# EAGLE design pHORPBoard_V10 (EAGLE 7.7.0)

## Sheet 1 of 3
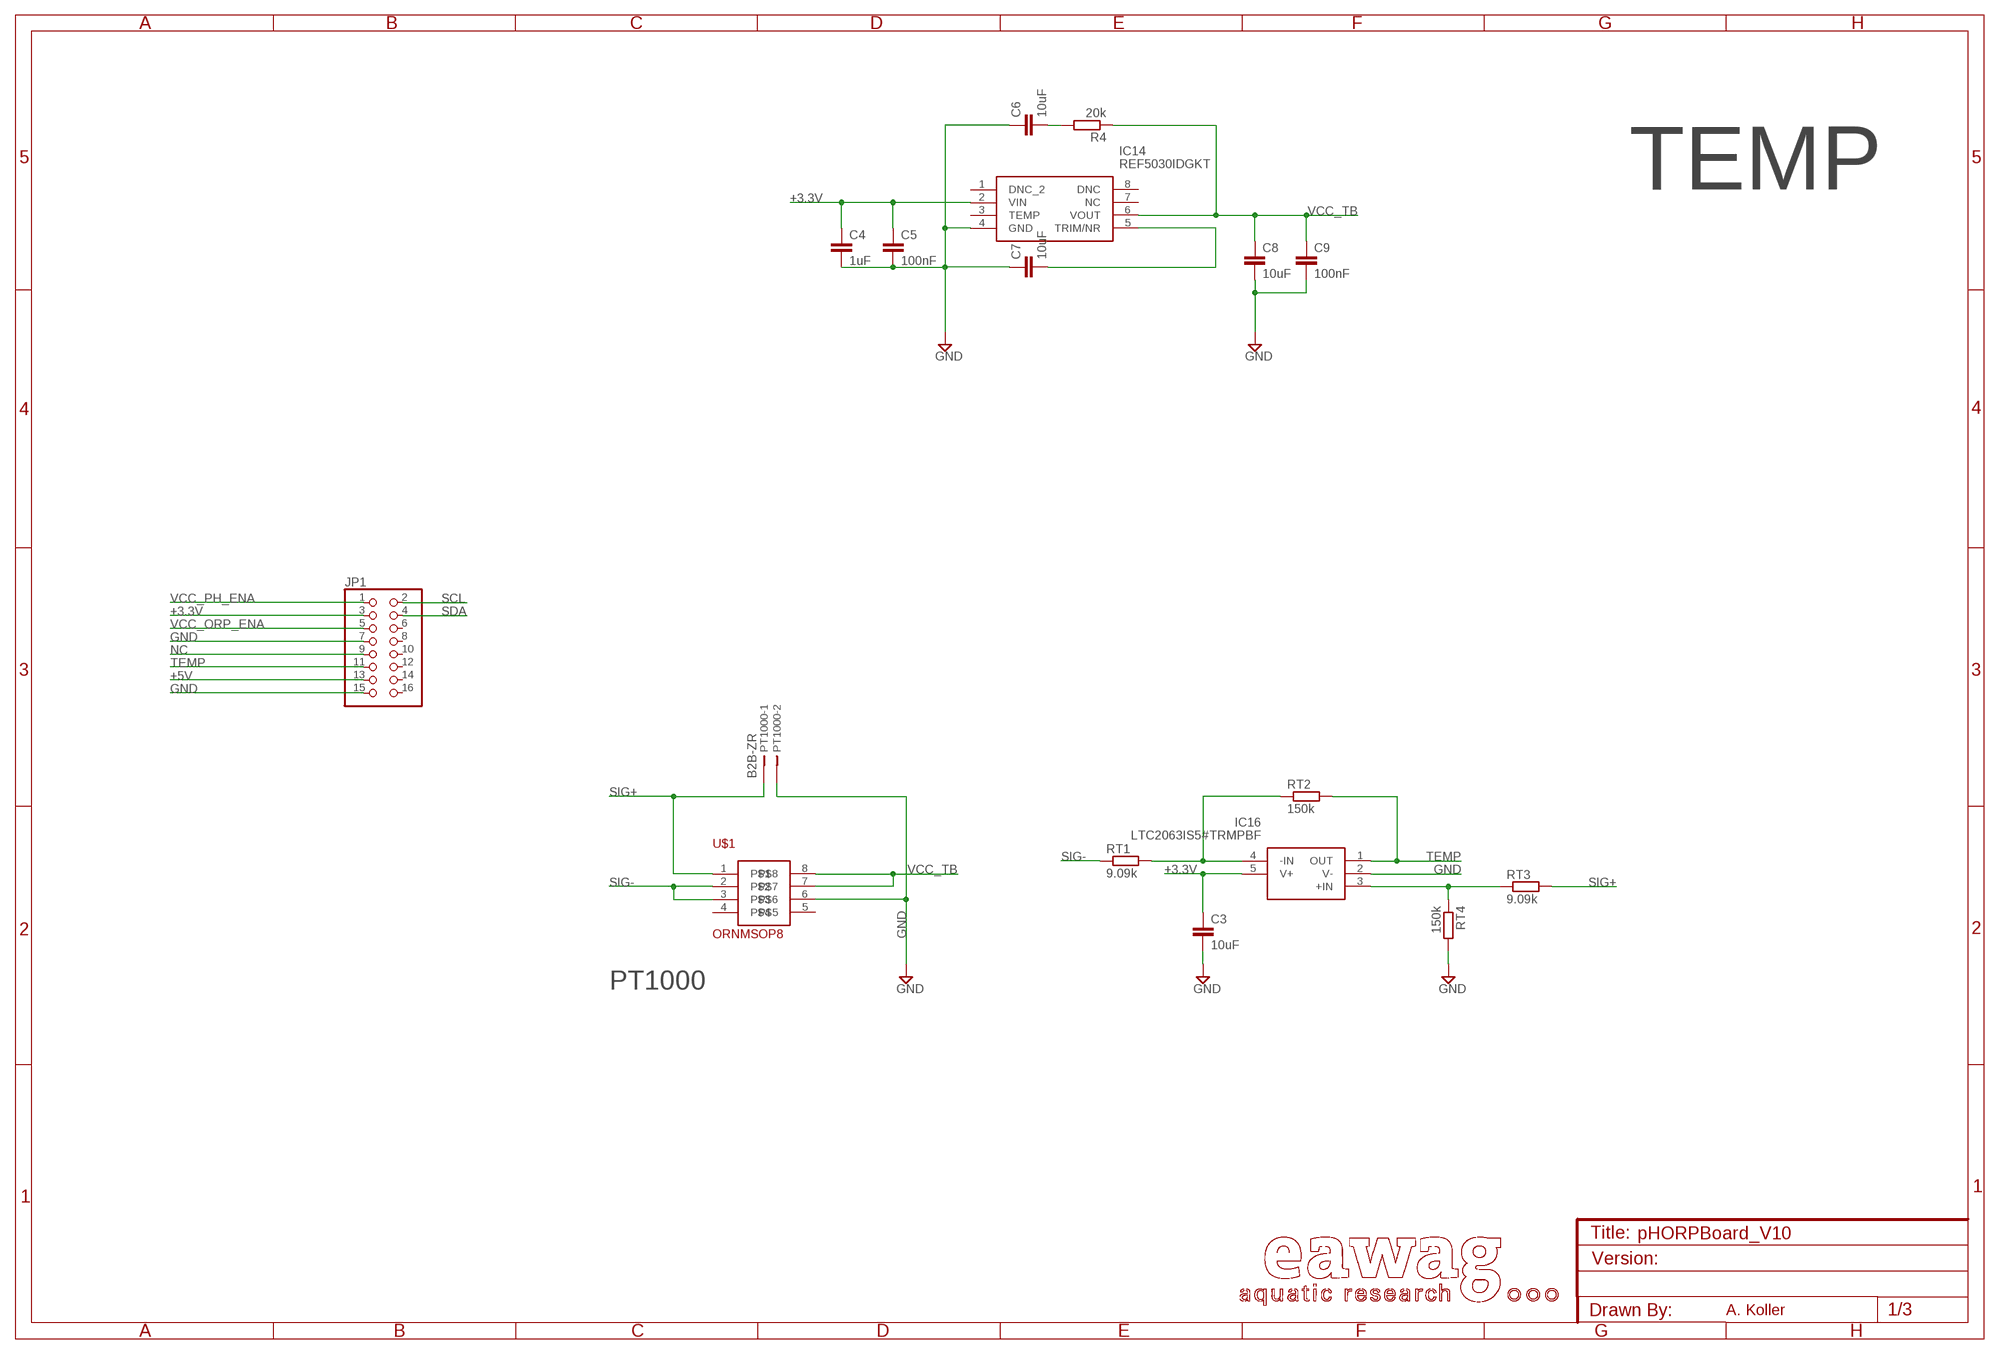
[diagram p0: schematic, sheet 1]

### Parts
C3  10uF  C-EUC0603  [C0603]
C4  1uF  C-EUC0603  [C0603]
C5  100nF  C-EUC0603  [C0603]
C6  10uF  C-EUC0603  [C0603]
C7  10uF  C-EUC0603  [C0603]
C8  10uF  C-EUC0603  [C0603]
C9  100nF  C-EUC0603  [C0603]
IC14  REF5030IDGKT  [SOP65P490X110-8N]
IC16  LTC2063IS5#TRMPBF  [SOT95P280X100-5N]
JP1  PINHD-2X8  [2X08]
PT1000  B2B-ZR  [B2B-ZR]
R4  20k  R-EU_R0603  [R0603]
RT1  9.09k  R-EU_R0603  [R0603]
RT2  150k  R-EU_R0603  [R0603]
RT3  9.09k  R-EU_R0603  [R0603]
RT4  150k  R-EU_R0603  [R0603]
U$1  ORNMSOP8  [MSOP8]

### Nets
+3.3V: C3.1 C4.1 C5.1 IC14.2(VIN) IC16.5(V+) JP1.3
+5V: JP1.13 ; also sheet 2,3
GND: C3.2 C4.2 C5.2 C6.1 C7.1 C8.2 C9.2 IC14.4(GND) IC16.2(V-) JP1.7 JP1.15 PT1000.2 RT4.2 U$1.6 ; also sheet 2,3
N$3: IC16.4(-IN) RT1.2 RT2.1
N$7: IC16.3(+IN) RT3.1 RT4.1
N$9: C6.2 R4.2
N$21: C7.2 IC14.5(TRIM/NR)
NC: JP1.9
SCL: JP1.2 ; also sheet 2,3
SDA: JP1.4 ; also sheet 2,3
SIG+: PT1000.1 RT3.2 U$1.1
SIG-: RT1.1 U$1.2 U$1.3
TEMP: IC16.1(OUT) JP1.11 RT2.2
VCC_ORP_ENA: JP1.5 ; also sheet 2
VCC_PH_ENA: JP1.1 ; also sheet 3
VCC_TB: C8.1 C9.1 IC14.6(VOUT) R4.1 U$1.7 U$1.8
Unconnected: IC14.1(DNC_2) IC14.3(TEMP) IC14.7(NC) IC14.8(DNC) JP1.6 JP1.8 JP1.10 JP1.12 JP1.14 JP1.16 U$1.4 U$1.5

### Notes on the sheet
- TEMP
- PT1000
- A. Koller

## Sheet 2 of 3
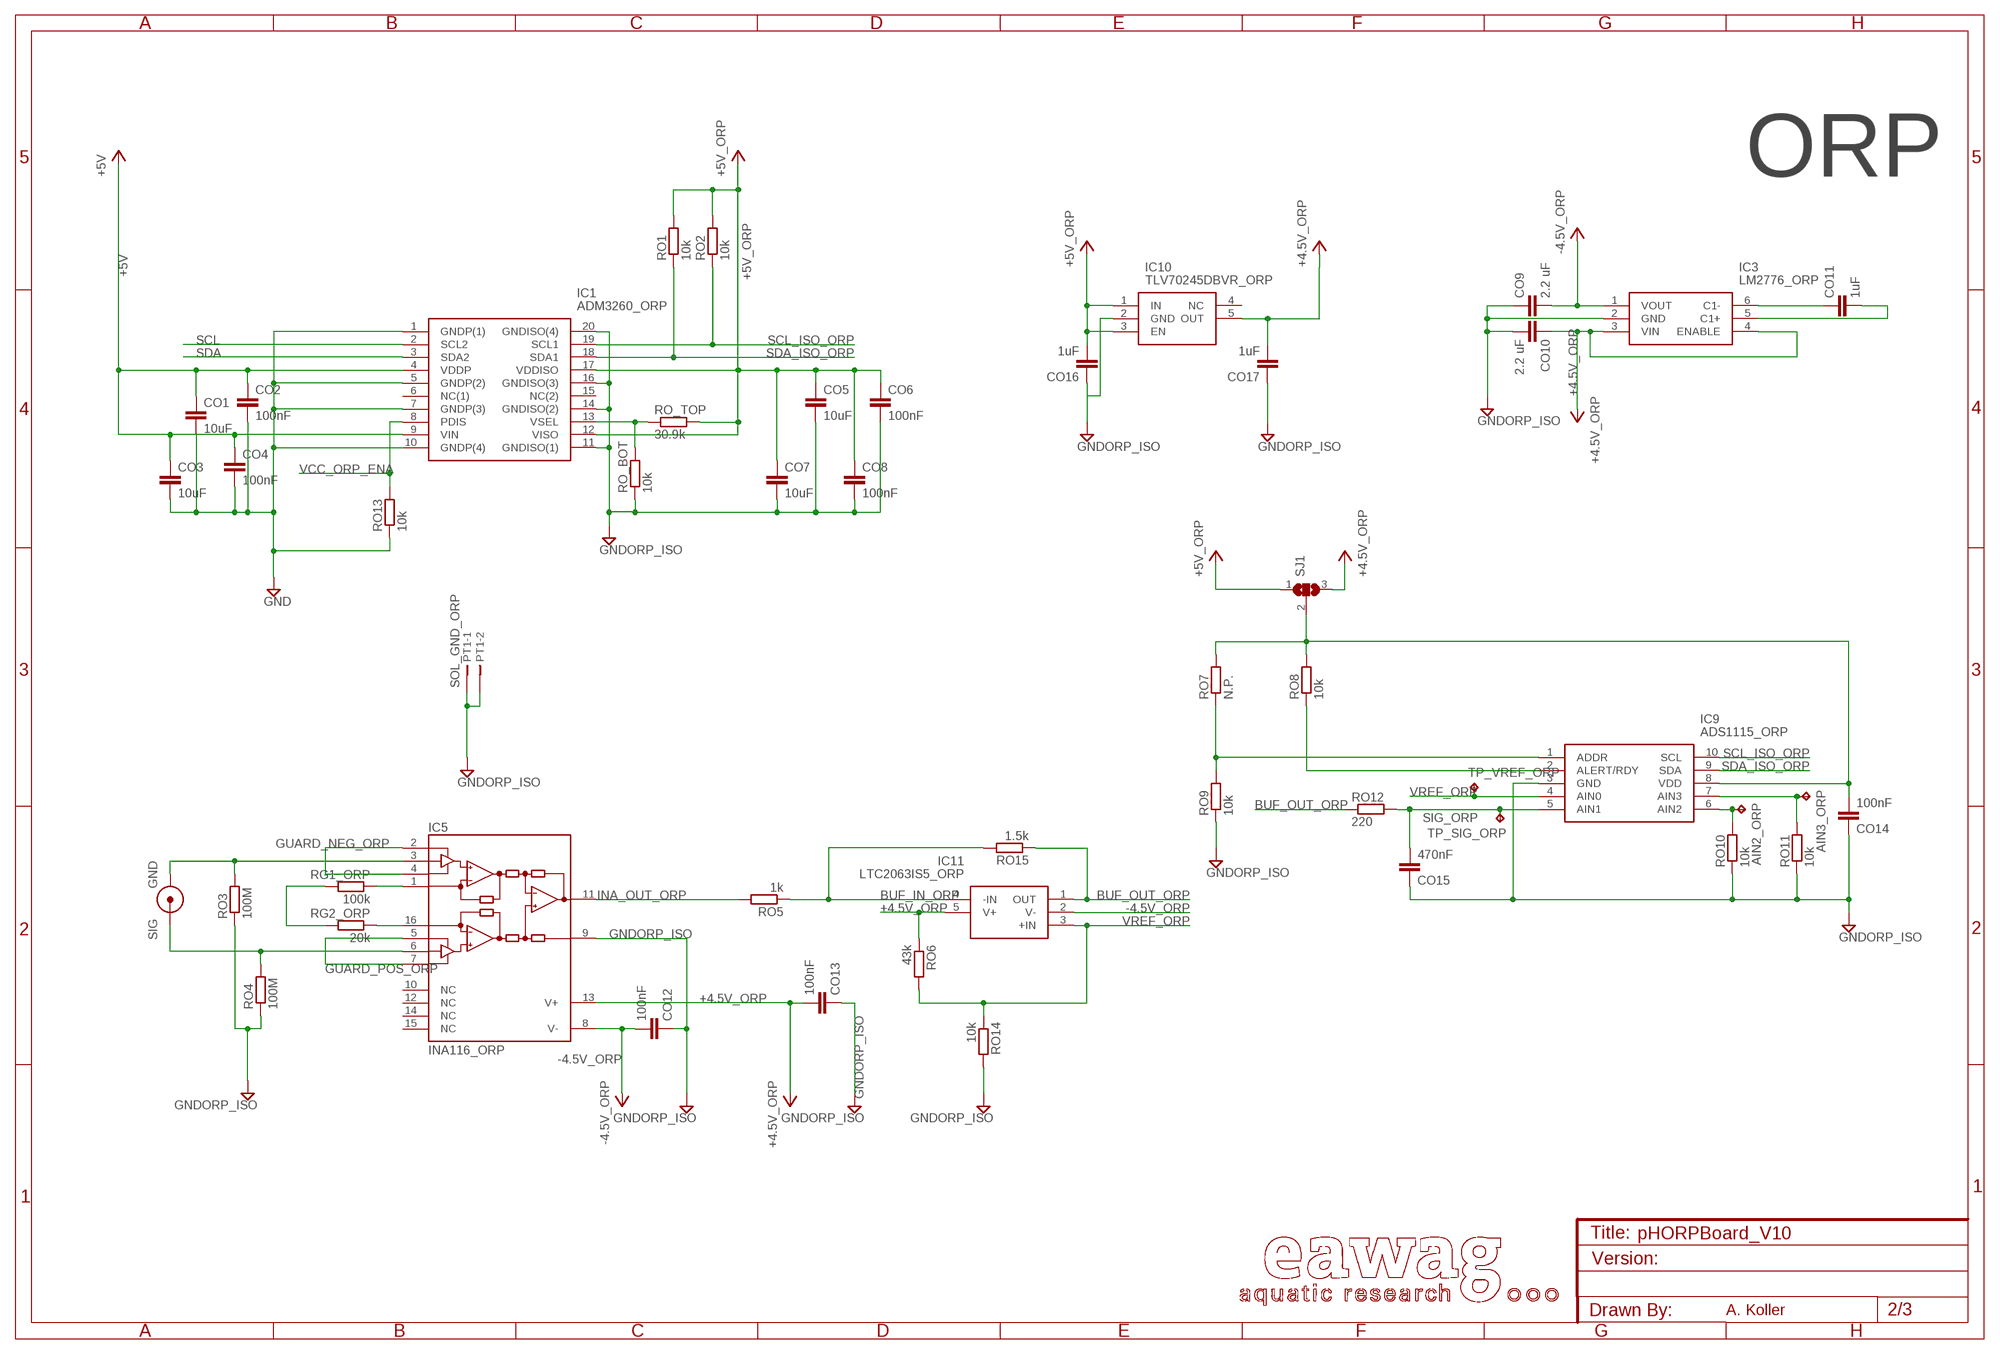
[diagram p1: schematic, sheet 2]

### Parts
AIN2_ORP  TPB1,27  [B1,27]
AIN3_ORP  TPB1,27  [B1,27]
CO1  10uF  C-EUC0603  [C0603]
CO2  100nF  C-EUC0603  [C0603]
CO3  10uF  C-EUC0603  [C0603]
CO4  100nF  C-EUC0603  [C0603]
CO5  10uF  C-EUC0603  [C0603]
CO6  100nF  C-EUC0603  [C0603]
CO7  10uF  C-EUC0603  [C0603]
CO8  100nF  C-EUC0603  [C0603]
CO9  2.2 uF  C-EUC0603  [C0603]
CO10  2.2 uF  C-EUC0603  [C0603]
CO11  1uF  C-EUC0603  [C0603]
CO12  100nF  C-EUC0603  [C0603]
CO13  100nF  C-EUC0603  [C0603]
CO14  100nF  C-EUC0603  [C0603]
CO15  470nF  C-EUC0603  [C0603]
CO16  1uF  C-EUC0603  [C0603]
CO17  1uF  C-EUC0603  [C0603]
IC1  ADM3260_ORP  ADM3260ARSZ-RL7  [SOP65P780X200-20N]
IC3  LM2776_ORP  LM2776DBVT  [SOT95P280X145-6N]
IC5  INA116_ORP  INA116U  [SO16-1]
IC9  ADS1115_ORP  ADS1115IDGST  [SOP50P490X110-10N]
IC10  TLV70245DBVR_ORP  TLV70245DBVR  [SOT95P280X145-5N]
IC11  LTC2063IS5_ORP  LTC2063IS5#TRMPBF  [SOT95P280X100-5N]
ORP  CON_HANNACON_HANNA_2  [CON_HANNA_2]
PT1  SOL_GND_ORP  B2B-ZR  [B2B-ZR]
RG1_ORP  100k  R-EU_R0603  [R0603]
RG2_ORP  20k  R-EU_R0603  [R0603]
RO1  10k  R-EU_R0603  [R0603]
RO2  10k  R-EU_R0603  [R0603]
RO3  100M  R-EU_R0603  [R0603]
RO4  100M  R-EU_R0603  [R0603]
RO5  1k  R-EU_R0603  [R0603]
RO6  43k  R-EU_R0603  [R0603]
RO7  N.P.  R-EU_R0603  [R0603]
RO8  10k  R-EU_R0603  [R0603]
RO9  10k  R-EU_R0603  [R0603]
RO10  10k  R-EU_R0603  [R0603]
RO11  10k  R-EU_R0603  [R0603]
RO12  220  R-EU_R0603  [R0603]
RO13  10k  R-EU_R0603  [R0603]
RO14  10k  R-EU_R0603  [R0603]
RO15  1.5k  R-EU_R0603  [R0603]
RO_BOT  10k  R-EU_R0603  [R0603]
RO_TOP  30.9k  R-EU_R0603  [R0603]
SJ1  SJ2W  [SJ_2]
TP_SIG_ORP  TPB1,27  [B1,27]
TP_VREF_ORP  TPB1,27  [B1,27]

### Nets
+4.5V_ORP: CO10.1 CO13.2 CO17.2 IC3.3(VIN) IC3.4(ENABLE) IC5.13(V+) IC10.5(OUT) IC11.5(V+) RO6.1 SJ1.3
+5V: CO1.1 CO2.1 CO3.1 CO4.1 IC1.4(VDDP) IC1.9(VIN) ; also sheet 1,3
+5V_ORP: CO5.1 CO6.1 CO7.1 CO8.1 CO16.2 IC1.12(VISO) IC1.17(VDDISO) IC10.1(IN) IC10.3(EN) RO1.2 RO2.2 RO_TOP.2 SJ1.1
-4.5V_ORP: CO9.2 CO12.2 IC3.1(VOUT) IC5.8(V-) IC11.2(V-)
BUF_IN_ORP: IC11.4(-IN) RO5.1 RO15.2
BUF_OUT_ORP: IC11.1(OUT) RO12.1 RO15.1
GND: CO1.2 CO2.2 CO3.2 CO4.2 IC1.1(GNDP(1)) IC1.5(GNDP(2)) IC1.7(GNDP(3)) IC1.10(GNDP(4)) RO13.1 ; also sheet 1,3
GNDORP_ISO: CO5.2 CO6.2 CO7.2 CO8.2 CO9.1 CO10.2 CO12.1 CO13.1 CO14.1 CO15.1 CO16.1 CO17.1 IC1.11(GNDISO(1)) IC1.14(GNDISO(2)) IC1.16(GNDISO(3)) IC1.20(GNDISO(4)) IC3.2(GND) IC5.9(REF) IC9.3(GND) IC10.2(GND) PT1.1 PT1.2 RO3.1 RO4.1 RO9.1 RO10.1 RO11.1 RO14.2 RO_BOT.1
GUARD_NEG_ORP: IC5.2(GUARD-) IC5.4(GUARD-)
GUARD_POS_ORP: IC5.5(GUARD+) IC5.7(GUARD+)
INA_OUT_ORP: IC5.11(OUT) RO5.2
N$6: IC5.6(+IN) ORP.CON_SIG RO4.2
N$10: CO11.1 IC3.6(C1-)
N$11: CO11.2 IC3.5(C1+)
N$12: IC5.3(-IN) ORP.CON_GND RO3.2
N$13: IC5.1(RG) RG1_ORP.1
N$14: RG1_ORP.2 RG2_ORP.2
N$20: IC5.16(RG) RG2_ORP.1
N$22: IC9.1(ADDR) RO7.1 RO9.2
N$23: IC9.2(ALERT/RDY) RO8.1
N$24: AIN2_ORP.TP IC9.6(AIN2) RO10.2
N$25: AIN3_ORP.TP IC9.7(AIN3) RO11.2
SCL: IC1.2(SCL2) ; also sheet 1,3
SCL_ISO_ORP: IC1.19(SCL1) IC9.10(SCL) RO2.1
SDA: IC1.3(SDA2) ; also sheet 1,3
SDA_ISO_ORP: IC1.18(SDA1) IC9.9(SDA) RO1.1
SIG_ORP: CO15.2 IC9.5(AIN1) RO12.2 TP_SIG_ORP.TP
SUPP_ADS_ORP: CO14.2 IC9.8(VDD) RO7.2 RO8.2 SJ1.2
VCC_ORP_ENA: IC1.8(PDIS) RO13.2 ; also sheet 1
VREF_ORP: IC9.4(AIN0) IC11.3(+IN) RO6.2 RO14.1 TP_VREF_ORP.TP
VSEL: IC1.13(VSEL) RO_BOT.2 RO_TOP.1
Unconnected: IC1.6(NC(1)) IC1.15(NC(2)) IC5.10(NC) IC5.12(NC) IC5.14(NC) IC5.15(NC) IC10.4(NC)

### Notes on the sheet
- ORP
- A. Koller

## Sheet 3 of 3
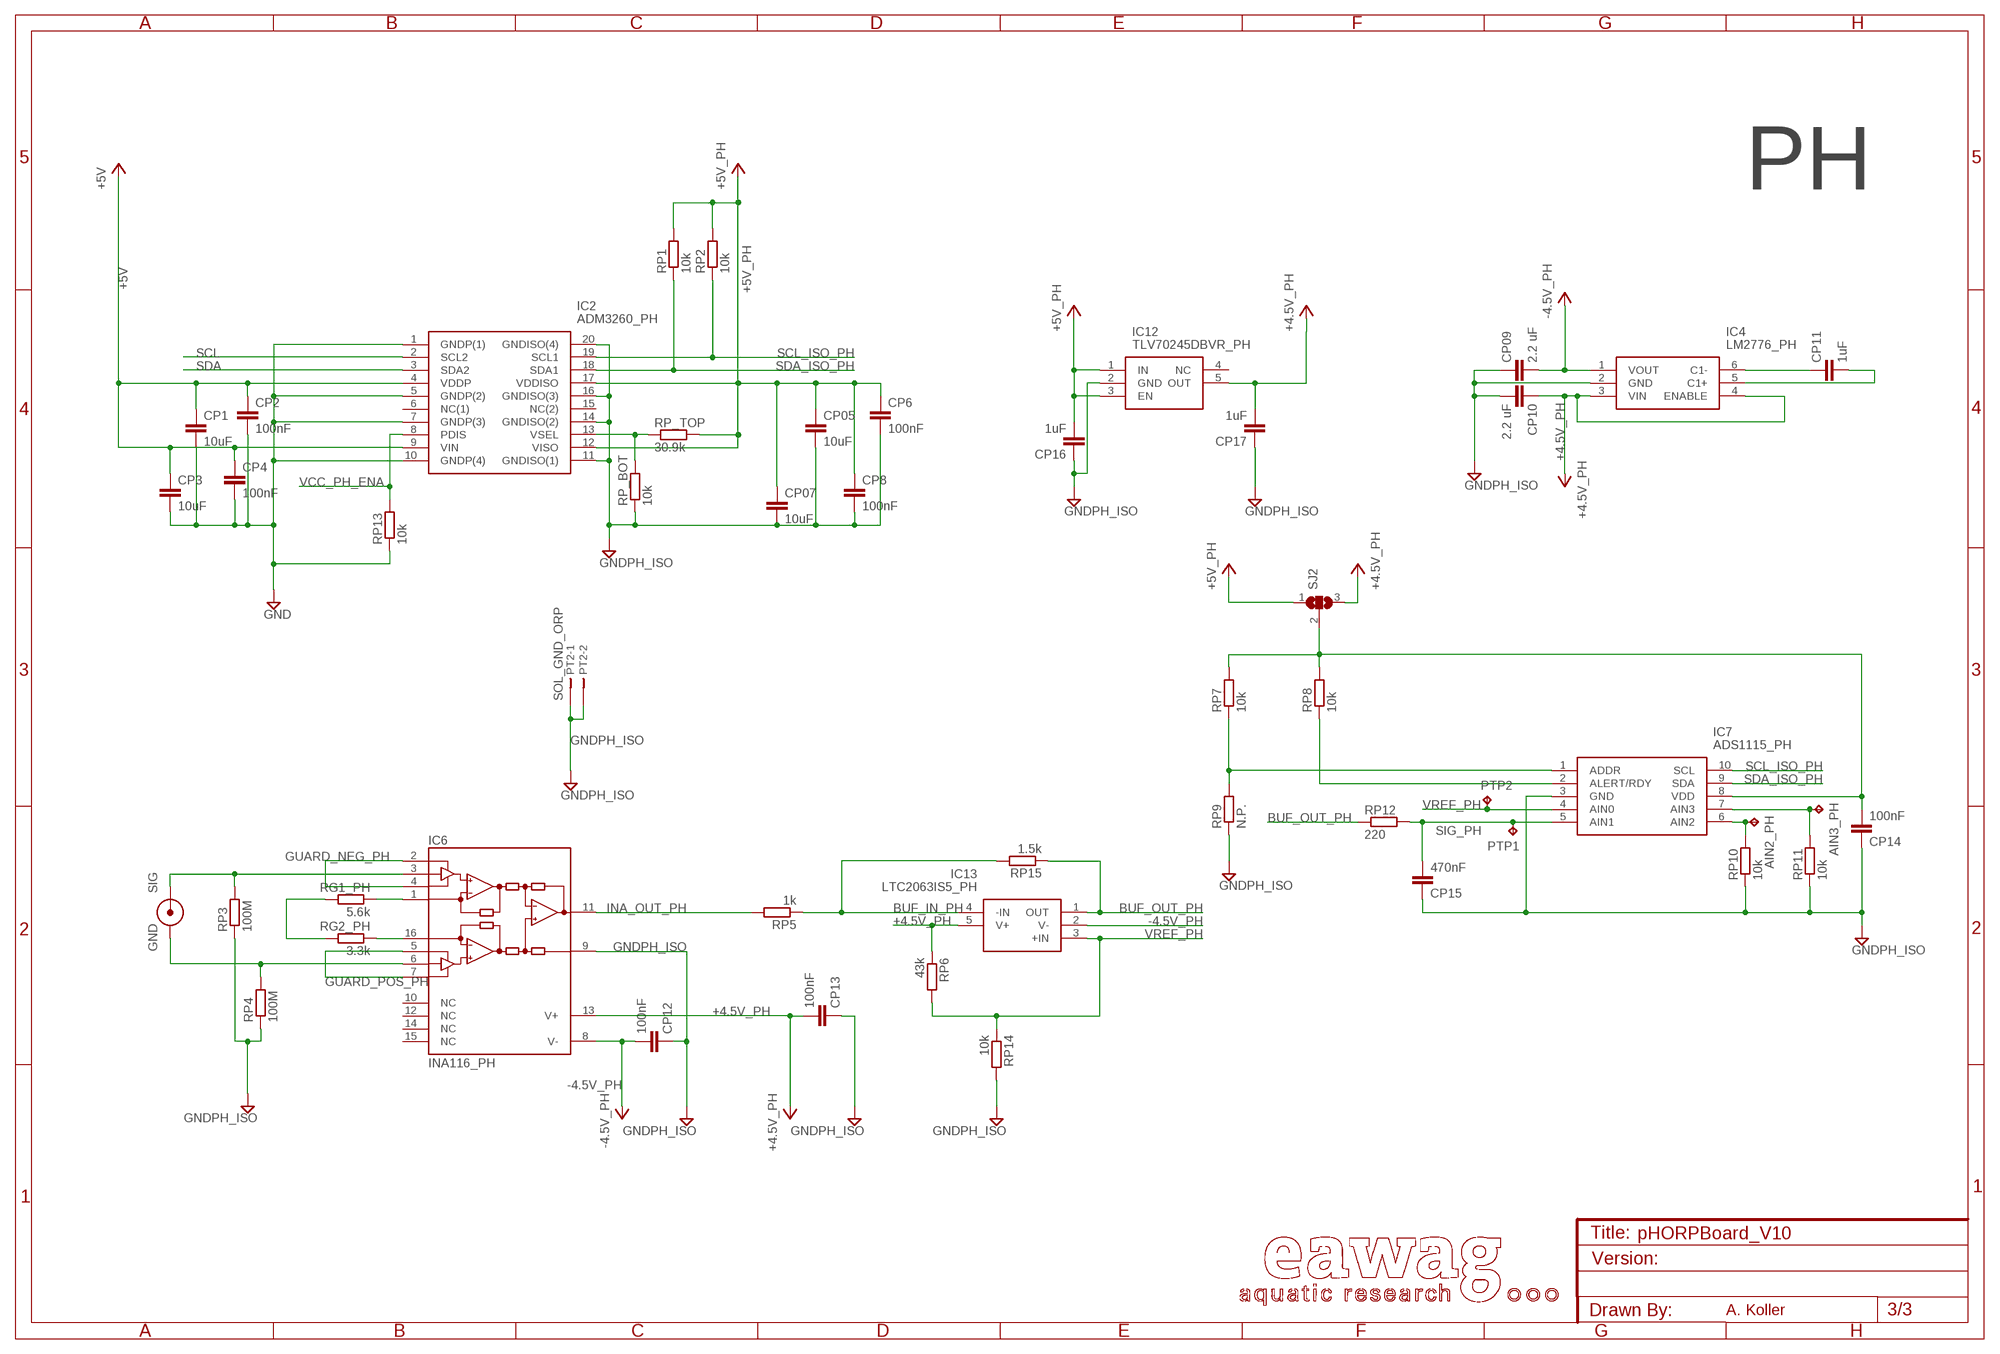
[diagram p2: schematic, sheet 3]

### Parts
AIN2_PH  TPB1,27  [B1,27]
AIN3_PH  TPB1,27  [B1,27]
CP1  10uF  C-EUC0603  [C0603]
CP2  100nF  C-EUC0603  [C0603]
CP3  10uF  C-EUC0603  [C0603]
CP4  100nF  C-EUC0603  [C0603]
CP05  10uF  C-EUC0603  [C0603]
CP6  100nF  C-EUC0603  [C0603]
CP07  10uF  C-EUC0603  [C0603]
CP8  100nF  C-EUC0603  [C0603]
CP09  2.2 uF  C-EUC0603  [C0603]
CP10  2.2 uF  C-EUC0603  [C0603]
CP11  1uF  C-EUC0603  [C0603]
CP12  100nF  C-EUC0603  [C0603]
CP13  100nF  C-EUC0603  [C0603]
CP14  100nF  C-EUC0603  [C0603]
CP15  470nF  C-EUC0603  [C0603]
CP16  1uF  C-EUC0603  [C0603]
CP17  1uF  C-EUC0603  [C0603]
IC2  ADM3260_PH  ADM3260ARSZ-RL7  [SOP65P780X200-20N]
IC4  LM2776_PH  LM2776DBVT  [SOT95P280X145-6N]
IC6  INA116_PH  INA116U  [SO16-1]
IC7  ADS1115_PH  ADS1115IDGST  [SOP50P490X110-10N]
IC12  TLV70245DBVR_PH  TLV70245DBVR  [SOT95P280X145-5N]
IC13  LTC2063IS5_PH  LTC2063IS5#TRMPBF  [SOT95P280X100-5N]
PH  CON_HANNA  [CON_HANNA]
PT2  SOL_GND_ORP  B2B-ZR  [B2B-ZR]
PTP1  TPB1,27  [B1,27]
PTP2  TPB1,27  [B1,27]
RG1_PH  5.6k  R-EU_R0603  [R0603]
RG2_PH  3.3k  R-EU_R0603  [R0603]
RP1  10k  R-EU_R0603  [R0603]
RP2  10k  R-EU_R0603  [R0603]
RP3  100M  R-EU_R0603  [R0603]
RP4  100M  R-EU_R0603  [R0603]
RP5  1k  R-EU_R0603  [R0603]
RP6  43k  R-EU_R0603  [R0603]
RP7  10k  R-EU_R0603  [R0603]
RP8  10k  R-EU_R0603  [R0603]
RP9  N.P.  R-EU_R0603  [R0603]
RP10  10k  R-EU_R0603  [R0603]
RP11  10k  R-EU_R0603  [R0603]
RP12  220  R-EU_R0603  [R0603]
RP13  10k  R-EU_R0603  [R0603]
RP14  10k  R-EU_R0603  [R0603]
RP15  1.5k  R-EU_R0603  [R0603]
RP_BOT  10k  R-EU_R0603  [R0603]
RP_TOP  30.9k  R-EU_R0603  [R0603]
SJ2  SJ2W  [SJ_2]

### Nets
+4.5V_PH: CP10.1 CP13.2 CP17.2 IC4.3(VIN) IC4.4(ENABLE) IC6.13(V+) IC12.5(OUT) IC13.5(V+) RP6.1 SJ2.3
+5V: CP1.1 CP2.1 CP3.1 CP4.1 IC2.4(VDDP) IC2.9(VIN) ; also sheet 1,2
+5V_PH: CP05.1 CP6.1 CP07.1 CP8.1 CP16.2 IC2.12(VISO) IC2.17(VDDISO) IC12.1(IN) IC12.3(EN) RP1.2 RP2.2 RP_TOP.2 SJ2.1
-4.5V_PH: CP09.2 CP12.2 IC4.1(VOUT) IC6.8(V-) IC13.2(V-)
BUF_IN_PH: IC13.4(-IN) RP5.1 RP15.2
BUF_OUT_PH: IC13.1(OUT) RP12.1 RP15.1
GND: CP1.2 CP2.2 CP3.2 CP4.2 IC2.1(GNDP(1)) IC2.5(GNDP(2)) IC2.7(GNDP(3)) IC2.10(GNDP(4)) RP13.1 ; also sheet 1,2
GNDPH_ISO: CP05.2 CP6.2 CP07.2 CP8.2 CP09.1 CP10.2 CP12.1 CP13.1 CP14.1 CP15.1 CP16.1 CP17.1 IC2.11(GNDISO(1)) IC2.14(GNDISO(2)) IC2.16(GNDISO(3)) IC2.20(GNDISO(4)) IC4.2(GND) IC6.9(REF) IC7.3(GND) IC12.2(GND) PT2.1 PT2.2 RP3.1 RP4.1 RP9.1 RP10.1 RP11.1 RP14.2 RP_BOT.1
GUARD_NEG_PH: IC6.2(GUARD-) IC6.4(GUARD-)
GUARD_POS_PH: IC6.5(GUARD+) IC6.7(GUARD+)
INA_OUT_PH: IC6.11(OUT) RP5.2
N$1: CP11.1 IC4.6(C1-)
N$2: CP11.2 IC4.5(C1+)
N$4: IC6.1(RG) RG1_PH.1
N$5: RG1_PH.2 RG2_PH.2
N$16: IC6.16(RG) RG2_PH.1
N$18: IC6.6(+IN) PH.CON_GND RP4.2
N$26: IC6.3(-IN) PH.CON_SIG RP3.2
N$27: IC7.1(ADDR) RP7.1 RP9.2
N$28: IC7.2(ALERT/RDY) RP8.1
N$31: AIN2_PH.TP IC7.6(AIN2) RP10.2
N$32: AIN3_PH.TP IC7.7(AIN3) RP11.2
SCL: IC2.2(SCL2) ; also sheet 1,2
SCL_ISO_PH: IC2.19(SCL1) IC7.10(SCL) RP2.1
SDA: IC2.3(SDA2) ; also sheet 1,2
SDA_ISO_PH: IC2.18(SDA1) IC7.9(SDA) RP1.1
SIG_PH: CP15.2 IC7.5(AIN1) PTP1.TP RP12.2
SUPP_ADS_PH: CP14.2 IC7.8(VDD) RP7.2 RP8.2 SJ2.2
VCC_PH_ENA: IC2.8(PDIS) RP13.2 ; also sheet 1
VREF_PH: IC7.4(AIN0) IC13.3(+IN) PTP2.TP RP6.2 RP14.1
VSEL1: IC2.13(VSEL) RP_BOT.2 RP_TOP.1
Unconnected: IC2.6(NC(1)) IC2.15(NC(2)) IC6.10(NC) IC6.12(NC) IC6.14(NC) IC6.15(NC) IC12.4(NC)

### Notes on the sheet
- PH
- A. Koller

## Library data of the parts
AIN2_ORP AIN2_PH AIN3_ORP AIN3_PH PTP1 PTP2 TP_SIG_ORP TP_VREF_ORP = testpad:TP: Test pad
C3-C9 CO1 CO3 CO7 CP1 CP3 CP05 CP07 CP10 = 1_RCL-eawag:C-EU: CAPACITOR, European symbol
CO2 CO4-CO6 CO8-CO17 CP2 CP4 CP6 CP8 CP09 CP11-CP17 = rcl:C-EU: CAPACITOR, European symbol
IC1 IC2 = ADM3260ARSZ-RL7:ADM3260ARSZ-RL7: Digital Isolators Isolated I2C & Power Source: Datasheet <https://componentsearchengine.com/Datasheets/1/ADM3260ARSZ-RL7.pdf>; DESCRIPTION: Digital Isolators Isolated I2C & Power; HEIGHT: 2mm; MANUFACTURER_NAME: Analog Devices; MANUFACTURER_PART_NUMBER: ADM3260ARSZ-RL7; SUPPLIER_NAME: RS
IC3 IC4 = LM2776DBVT:LM2776DBVT: TEXAS INSTRUMENTS - LM2776DBVT - CHARGE PUMP, INV, -2.7V TO -5.5V, SOT-23 Source: Datasheet <http://www.ti.com/lit/ds/symlink/lm2776.pdf>; DESCRIPTION: TEXAS INSTRUMENTS - LM2776DBVT - CHARGE PUMP, INV, -2.7V TO -5.5V, SOT-23; HEIGHT: 1.45mm; MANUFACTURER_NAME: Texas Instruments; MANUFACTURER_PART_NUMBER: LM2776DBVT; SUPPLIER_NAME: RS
IC5 IC6 = burr-brown:INA116: Instrumentation Amplifier Ultra Low Input Bias Current; MF: TEXAS INSTRUMENTS; MPN: INA116UA; OC_FARNELL: 1212402; OC_NEWARK: 35C1717
IC7 IC9 = ADS1115IDGST:ADS1115IDGST: 16-Bit, 860SPS, 4-Ch Delta-Sigma ADC w/ PGA, Oscillator, Voltage Reference, Comparator & I2C Source: Datasheet <http://docs-europe.electrocomponents.com/webdocs/0e31/0900766b80e31b07.pdf>; DESCRIPTION: 16-Bit, 860SPS, 4-Ch Delta-Sigma ADC w/ PGA, Oscillator, Voltage Reference, Comparator & I2C; HEIGHT: 1.1mm; MANUFACTURER_NAME: Texas Instruments; MANUFACTURER_PART_NUMBER: ADS1115IDGST; RS_PART_NUMBER: 9236911; RS_PRICE/STOCK: http://uk.rs-online.com/web/p/products/9236911
IC10 IC12 = TLV70245DBVR:TLV70245DBVR: LDO Voltage Regulators 300mALow IQLDO Reg Source: Datasheet <http://www.ti.com/lit/ds/symlink/tlv702.pdf>; ARROW_PART_NUMBER: TLV70245DBVR; ARROW_PRICE/STOCK: https://www.arrow.com/en/products/TLV70245dbvr/texas-instruments; DESCRIPTION: LDO Voltage Regulators 300mALow IQLDO Reg; HEIGHT: 1.45mm; MANUFACTURER_NAME: Texas Instruments; MANUFACTURER_PART_NUMBER: TLV70245DBVR
IC11 IC13 IC16 = LTC2063IS5#TRMPBF:LTC2063IS5#TRMPBF: LINEAR TECHNOLOGY - LTC2063IS5#TRMPBF - OP-AMP, 20KHZ, 0.0035V/US, TSOT23-5 Source: Datasheet <http://cds.linear.com/docs/en/datasheet/2063f.pdf>; ARROW_PART_NUMBER: LTC2063IS5#TRMPBF; ARROW_PRICE/STOCK: https://www.arrow.com/en/products/ltc2063is5trmpbf/linear-technology; DESCRIPTION: LINEAR TECHNOLOGY - LTC2063IS5#TRMPBF - OP-AMP, 20KHZ, 0.0035V/US, TSOT23-5; HEIGHT: 1mm; MANUFACTURER_NAME: Linear Technology; MANUFACTURER_PART_NUMBER: LTC2063IS5#TRMPBF
IC14 = REF5030IDGKT:REF5030IDGKT: VOLTAGE REFERENCE Source: Datasheet; ARROW_PART_NUMBER: REF5030IDGKT; DESCRIPTION: VOLTAGE REFERENCE; HEIGHT: mm; MANUFACTURER_NAME: Texas Instruments; MANUFACTURER_PART_NUMBER: REF5030IDGKT
JP1 = pinhead:PINHD-2X8: PIN HEADER
ORP PH = eawag:CON_HANNA
PT1 PT2 PT1000 = con-jst:B2B-ZR: ZH CONNECTOR 1.5 mm, 2 pin 1 row Source: http://www.jst.com .. eZH.pdf
R4 RG1_ORP RG1_PH RG2_ORP RG2_PH RO1-RO15 RO_BOT RO_TOP RP1-RP15 RP_BOT RP_TOP RT1-RT4 = resistor:R-EU_: RESISTOR, European symbol
SJ1 SJ2 = jumper:SJ2W: SMD solder JUMPER
U$1 = eawag:ORN

## Board
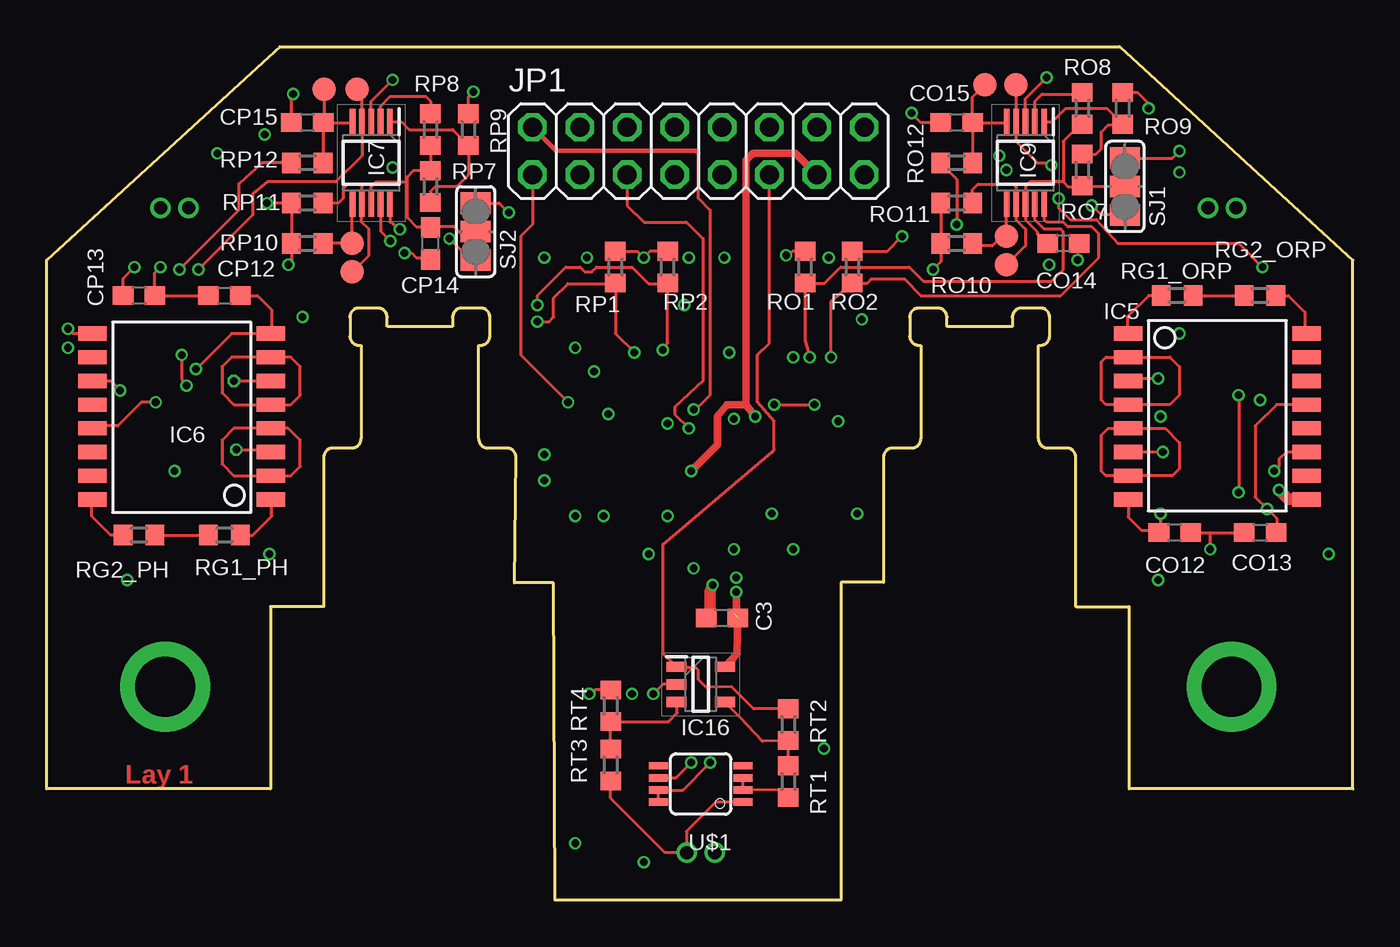
[diagram p3: board, top side]
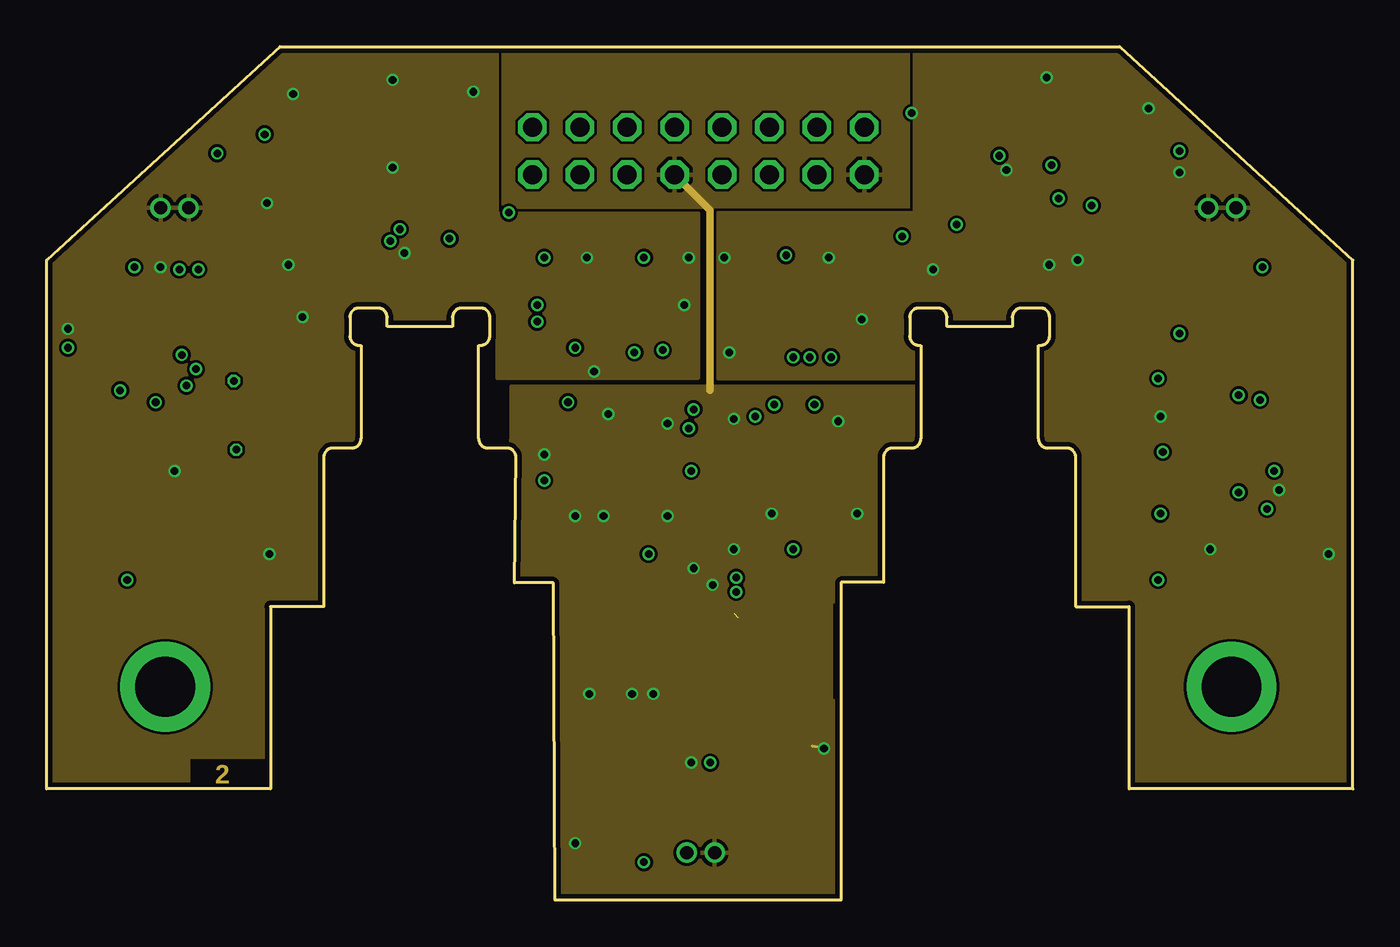
[diagram p4: board, inner layer Grounds]
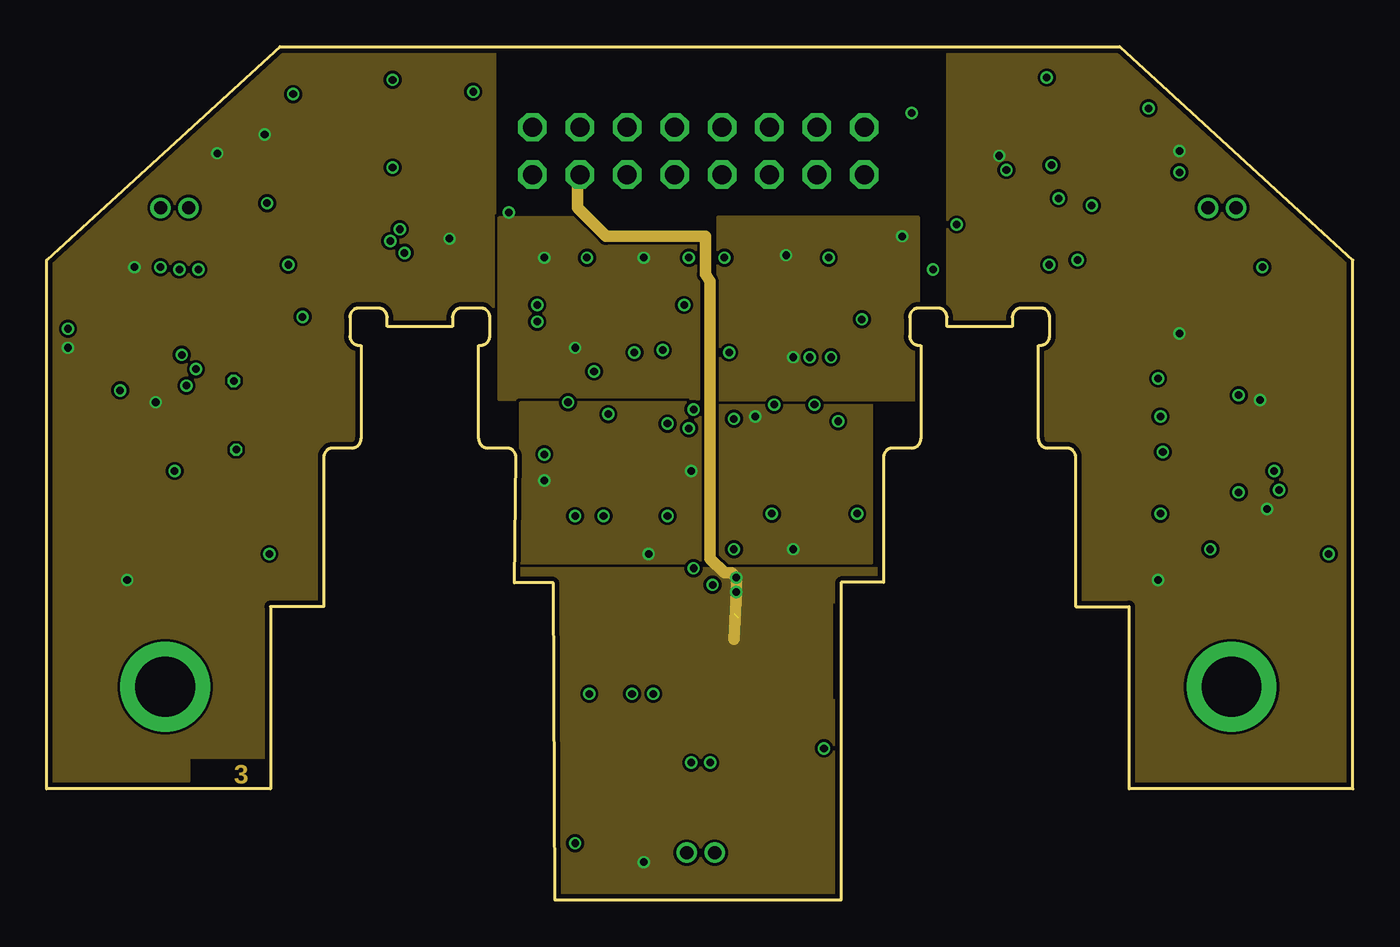
[diagram p5: board, inner layer Powers]
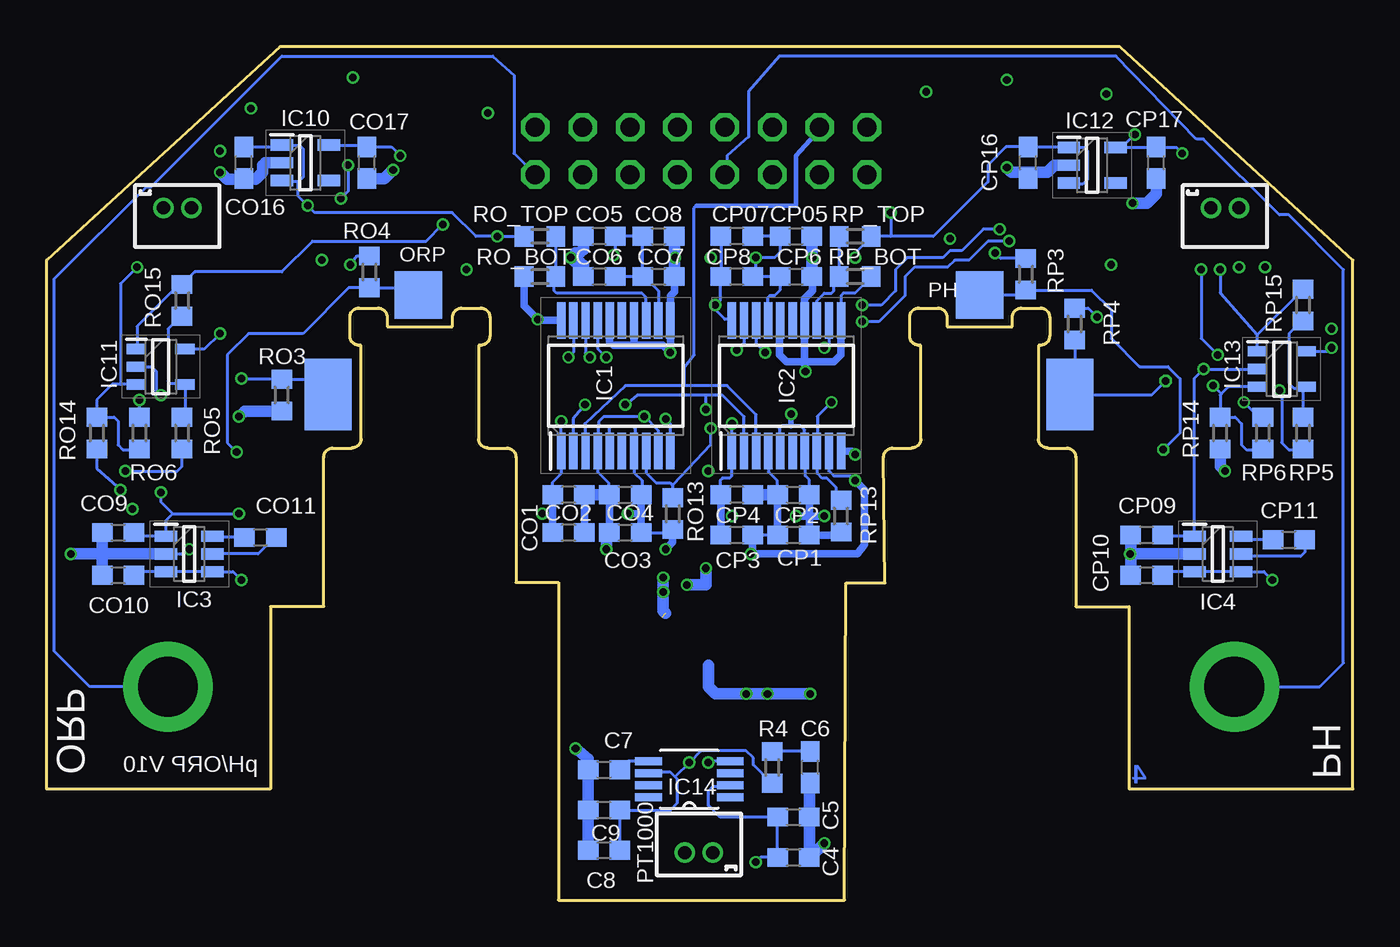
[diagram p6: board, bottom side, seen from below]

Size 70 x 45.72 mm. Coordinates in mm from the lower left corner, seen from the top.
Outline: 44.85,17.02 42.57,17.02 42.57,0 27.24,0 27.16,16.99 25.07,16.99 25.15,23.72 arc90 24.65,24.22 23.65,24.22 arc-90 23.15,24.72 23.15,29.72 23.25,29.72 arc90 23.75,30.22 23.75,31.22 arc90 23.25,31.72 22.25,31.72 arc90 21.75,31.22 21.75,30.72 18.25,30.72 18.25,31.22 arc90 17.75,31.72 16.75,31.72 arc90 16.25,31.22 16.25,30.22 arc90 16.75,29.72 16.85,29.72 16.85,24.72 arc-90 16.35,24.22 15.35,24.22 arc90 14.85,23.72 14.85,15.72 12,15.72 12,5.96 0,5.96 0,34.29 12.5,45.72 57.5,45.72 70,34.29 70,5.96 58,5.96 58,15.72 55.15,15.72 55.15,23.72 arc90 54.65,24.22 53.65,24.22 arc-90 53.15,24.72 53.15,29.72 53.25,29.72 arc90 53.75,30.22 53.75,31.22 arc90 53.25,31.72 52.25,31.72 arc90 51.75,31.22 51.75,30.72 48.25,30.72 48.25,31.22 arc90 47.75,31.72 46.75,31.72 arc90 46.25,31.22 46.25,30.22 arc90 46.75,29.72 46.85,29.72 46.85,24.72 arc-90 46.35,24.22 45.35,24.22 arc90 44.85,23.72 44.85,17.02
Copper layers (1+2*3+16): Top 0.018mm / dielectric 0.36mm / Grounds 0.035mm / dielectric 0.71mm / Powers 0.035mm / dielectric 0.36mm / Bottom 0.018mm
Design rules "eC_4Layer_PClass6_BaseCopperO18-I35_eCDefault": minimum track width 0.15mm, minimum drill 0.35mm, track to track 0.15mm, track to pad 0.15mm, pad to pad 0.15mm, via to via 0.15mm, smd to smd 0mil, copper to edge 0.25mm, drill to drill 0.35mm, minimum pad ring 0.175mm, minimum via ring 0.125mm, stop-mask expansion 0mil, vias tented up to drill 0.45mm, thermal gap 0.2mm

### Footprints (pad centres in the part's own frame; a part is rotated, then mirrored left to right if it is on the bottom)
B1,27 = smd 1.27 x 1.27: TP 0,0
C0603 = smd 1.1 x 1: 1 -0.85,0; 2 0.85,0
SOP65P780X200-20N = smd 1.95 x 0.45: 1 -3.5,2.925; 2 -3.5,2.275; 3 -3.5,1.625; 4 -3.5,0.975; 5 -3.5,0.325; 6 -3.5,-0.325; 7 -3.5,-0.975; 8 -3.5,-1.625; 9 -3.5,-2.275; 10 -3.5,-2.925; 11 3.5,-2.925; 12 3.5,-2.275; 13 3.5,-1.625; 14 3.5,-0.975; 15 3.5,-0.325; 16 3.5,0.325; 17 3.5,0.975; 18 3.5,1.625; 19 3.5,2.275; 20 3.5,2.925
SOT95P280X145-6N = smd 1.2 x 0.6: 1 -1.25,0.95; 2 -1.25,0; 3 -1.25,-0.95; 4 1.25,-0.95; 5 1.25,0; 6 1.25,0.95
SO16-1 = smd 0.762 x 1.524: 1 -4.445,-4.775; 2 -3.175,-4.775; 3 -1.905,-4.775; 4 -0.635,-4.775; 5 0.635,-4.775; 6 1.905,-4.775; 7 3.175,-4.775; 8 4.445,-4.775; 9 4.445,4.775; 10 3.175,4.775; 11 1.905,4.775; 12 0.635,4.775; 13 -0.635,4.775; 14 -1.905,4.775; 15 -3.175,4.775; 16 -4.445,4.775
SOP50P490X110-10N = smd 1.4 x 0.3: 1 -2.2,1; 2 -2.2,0.5; 3 -2.2,0; 4 -2.2,-0.5; 5 -2.2,-1; 6 2.2,-1; 7 2.2,-0.5; 8 2.2,0; 9 2.2,0.5; 10 2.2,1
SOT95P280X145-5N = smd 1.2 x 0.6: 1 -1.25,0.95; 2 -1.25,0; 3 -1.25,-0.95; 4 1.25,-0.95; 5 1.25,0.95
SOT95P280X100-5N = smd 1.05 x 0.55: 1 -1.3,0.95; 2 -1.3,0; 3 -1.3,-0.95; 4 1.3,-0.95; 5 1.3,0.95
SOP65P490X110-8N = smd 1.422 x 0.432: 1 -2.184,0.965; 2 -2.184,0.33; 3 -2.184,-0.33; 4 -2.184,-0.965; 5 2.184,-0.965; 6 2.184,-0.33; 7 2.184,0.33; 8 2.184,0.965
2X08 = drill 1.016 octagon: 1 -8.89,-1.27; 2 -8.89,1.27; 3 -6.35,-1.27; 4 -6.35,1.27; 5 -3.81,-1.27; 6 -3.81,1.27; 7 -1.27,-1.27; 8 -1.27,1.27; 9 1.27,-1.27; 10 1.27,1.27; 11 3.81,-1.27; 12 3.81,1.27; 13 6.35,-1.27; 14 6.35,1.27; 15 8.89,-1.27; 16 8.89,1.27
CON_HANNA_2 = smd 3.81 x 2.54: CON_GND 5.334,-4.826 | smd 2.54 x 2.54: CON_SIG 0,0
CON_HANNA = smd 3.81 x 2.54: CON_GND 5.334,4.826 | smd 2.54 x 2.54: CON_SIG 0,0
B2B-ZR = drill 0.7 pad 1.1: 1 -0.75,0; 2 0.75,0
R0603 = smd 1 x 1.1: 1 -0.85,0; 2 0.85,0
SJ_2 = smd 1.168 x 1.6: 1 -1.524,0; 2 0,0; 3 1.524,0
MSOP8 = smd 0.4 x 1: 1 -0.976,-2.263; 2 -0.326,-2.263; 3 0.324,-2.263; 4 0.974,-2.263; 5 0.974,2.262; 6 0.324,2.262; 7 -0.326,2.262; 8 -0.976,2.262

### Placement (x,y rotation side)
AIN2_ORP  51.44,35.56 0 top
AIN2_PH  16.38,35.18 0 top
AIN3_ORP  51.44,34.04 0 top
AIN3_PH  16.38,33.66 0 top
C3  36.2,15.11 180 top
C4  29.97,2.29 0 bottom
C5  29.97,4.45 0 bottom
C6  29.08,7.11 90 bottom
C7  40.13,6.99 0 bottom
C8  40.13,2.67 180 bottom
C9  40.13,4.83 180 bottom
CO1  42.04,19.68 180 bottom
CO2  42.04,21.72 180 bottom
CO3  38.99,19.68 0 bottom
CO4  38.99,21.72 0 bottom
CO5  40.39,35.56 180 bottom
CO6  40.39,33.4 180 bottom
CO7  37.21,33.4 0 bottom
CO8  37.21,35.56 0 bottom
CO9  66.17,19.68 0 bottom
CO10  66.17,17.4 180 bottom
CO11  58.55,19.43 0 bottom
CO12  60.45,19.68 180 top
CO13  65.02,19.68 0 top
CO14  54.48,35.18 180 top
CO15  48.77,41.66 0 top
CO16  59.44,39.5 90 bottom
CO17  52.83,39.5 90 bottom
CP1  29.97,19.56 0 bottom
CP2  29.97,21.72 0 bottom
CP3  33.02,19.56 180 bottom
CP4  33.02,21.72 180 bottom
CP05  29.84,35.56 0 bottom
CP6  29.84,33.4 0 bottom
CP07  33.02,35.56 180 bottom
CP8  33.02,33.4 180 bottom
CP09  11.05,19.56 0 bottom
CP10  11.05,17.4 180 bottom
CP11  3.43,19.3 0 bottom
CP12  9.53,32.38 0 top
CP13  4.95,32.38 180 top
CP14  20.57,35.18 90 top
CP15  13.97,41.66 0 top
CP16  17.4,39.5 90 bottom
CP17  10.54,39.5 90 bottom
IC1  39.5,27.56 90 bottom
IC2  30.35,27.56 90 bottom
IC3  62.36,18.54 0 bottom
IC4  7.24,18.54 0 bottom
IC5  62.74,25.91 270 top
IC6  7.24,25.91 90 top
IC7  17.4,39.5 270 top
IC9  52.45,39.5 270 top
IC10  56.13,39.5 0 bottom
IC11  63.88,28.57 0 bottom
IC12  13.97,39.37 0 bottom
IC13  3.81,28.45 0 bottom
IC14  35.56,6.48 180 bottom
IC16  35.05,11.56 0 top
JP1  34.92,40.13 0 top
ORP  50.09,32.42 270 bottom
PH  19.99,32.42 270 bottom
PT1  62.99,37.08 0 bottom
PT2  6.86,37.08 0 bottom
PT1000  35.05,2.54 180 bottom
PTP1  14.86,43.43 0 top
PTP2  16.64,43.43 0 top
R4  31.11,7.11 90 bottom
RG1_ORP  60.58,32.38 0 top
RG1_PH  9.53,19.56 180 top
RG2_ORP  65.02,32.38 180 top
RG2_PH  4.95,19.56 0 top
RO1  40.64,33.91 90 top
RO2  43.18,33.91 90 top
RO3  57.4,27.05 90 bottom
RO4  52.7,33.66 270 bottom
RO5  62.74,25.02 270 bottom
RO6  65.02,25.02 270 bottom
RO7  55.5,39.12 270 top
RO8  55.5,42.42 270 top
RO9  57.66,42.42 270 top
RO10  48.77,35.18 0 top
RO11  48.77,37.34 0 top
RO12  48.77,39.5 0 top
RO13  36.45,20.7 90 bottom
RO14  67.31,25.02 270 bottom
RO15  62.74,32.13 270 bottom
RO_BOT  43.56,33.4 0 bottom
RO_TOP  43.56,35.56 180 bottom
RP1  30.48,33.91 90 top
RP2  33.27,33.91 90 top
RP3  17.53,33.53 270 bottom
RP4  14.91,30.86 270 bottom
RP5  2.67,25.02 270 bottom
RP6  4.83,25.02 270 bottom
RP7  20.57,38.23 90 top
RP8  20.57,41.27 270 top
RP9  22.61,41.27 270 top
RP10  13.97,35.18 0 top
RP11  13.97,37.34 0 top
RP12  13.97,39.5 0 top
RP13  27.43,20.57 90 bottom
RP14  7.11,25.02 270 bottom
RP15  2.67,31.88 270 bottom
RP_BOT  26.67,33.4 180 bottom
RP_TOP  26.67,35.56 0 bottom
RT1  39.75,6.35 90 top
RT2  39.75,9.4 90 top
RT3  30.23,7.24 270 top
RT4  30.23,10.41 90 top
SJ1  57.78,38.23 90 top
SJ2  22.99,35.81 270 top
TP_SIG_ORP  50.29,43.69 0 top
TP_VREF_ORP  51.94,43.69 0 top
U$1  35.05,6.22 90 top

### Tracks (layer width: path | path; a pad name or v marks a point on that pad's centre or on a via)
+3.3V  (via drill 0.41)  (1 unrouted)
  Top 0.406: IC16.5 36.99,13.2 C3.1 | v36.96,16.51 36.96,15.46
  Powers 0.152: v32,2.03 31.88,2.03
  Powers 0.61: JP1.3 28.45,38.73 28.45,37.08 29.97,35.56 35.31,35.56 35.31,33.53 35.56,33.15 35.56,18.29 36.32,17.53 36.7,17.53 v36.96,17.27 v36.96,16.51 36.83,13.97
  Bottom 0.152: IC14.2 33.43,6.1 34.29,6.1 34.54,5.84 34.54,5.08 33.91,4.45 C5.1 C4.1 31.75,2.29 v32,2.03
  Bottom 0.61: 36.83,15.37 36.96,15.49 v36.96,16.51 v36.96,17.27
  pour Powers: 24.13,17.78 45.72,17.78 45.72,-1.27 24.13,-1.27
+4.5V_ORP  (via drill 0.41)
  Top 0.152: IC5.13 65.91,26.54 64.77,25.4 64.77,21.59 v65.41,20.95 65.91,20.45 65.91,19.72 CO13.2 | SJ1.3 60.33,39.75 v60.71,40.13
  Bottom 0.152: CO10.1 65.12,17.59 IC3.3 IC3.4 60.01,17.59 v59.56,17.14 | IC11.5 61.53,29.52 v60.71,30.35 | v51.05,39.88 51.52,40.35 CO17.2 52.93,40.45 IC10.5 | RO6.1 v65.02,26.8
  pour Powers: 48.26,29.21 52.07,29.21 52.83,29.21 52.83,5.59 70.23,5.59 70.23,45.72 48.26,45.72 48.26,45.47
+4.5V_PH  (via drill 0.41)
  Top 0.152: v5.84,26.67 5.08,26.67 3.81,25.4 2.59,25.4 IC6.13 | CP13.2 4.1,33.31 v4.7,33.91 | v21.59,35.43 22.23,34.8 22.48,34.8 SJ2.3
  Bottom 0.152: CP10.1 10.01,17.59 IC4.3 IC4.4 4.76,17.59 v4.32,17.14 | 10.57,40.32 IC12.5 12.38,40.32 v11.68,41.02 | 10.57,40.32 CP17.2 | RP6.1 5.04,25.87 v5.84,26.67 | IC13.5 1.34,29.4 v1.14,29.59 | 10.57,40.32 9.46,40.32 v9.14,40.01
  pour Powers (rank 4): 24,45.72 24,29.21 17.78,29.21 17.78,6.35 11.94,6.35 11.94,7.62 7.62,7.62 7.62,6.35 0,6.35 0,45.72
+5V  (via drill 0.41)
  Top 0.406: 37.47,26.54 37.47,39.62 37.85,40.01 40.13,40.01 JP1.13 | 37.47,26.54 v37.97,25.91 | 37.47,26.54 36.45,26.54 35.94,25.91 35.94,24.38 v34.54,22.99
  Bottom 0.152: CP1.1 CP3.1 | IC2.4 31.33,22.95 30.86,22.48 30.86,21.76 CP2.1 | CO4.1 39.88,21.76 39.88,22.35 40.47,22.95 IC1.4 40.39,25.65 40.13,25.91 v37.97,25.91 37.22,25.16 IC1.9 | IC2.9 28.08,23 27.81,22.73 26.92,22.73 v26.67,22.48
  Bottom 0.406: CP2.1 CP1.1 | CP3.1 32.17,18.54 26.54,18.54 26.16,19.05 26.16,21.97 v26.67,22.48 | CO3.1 CO4.1 | CO2.1 CO1.1
  Bottom 0.61: CP2.1 CP4.1 | CO4.1 CO2.1 | v40.01,18.8 40.01,19.56 39.88,19.68
  other vias: 32.26,18.54
  pour Powers (rank 2): 25.4,26.67 44.2,26.67 44.2,18.03 25.4,18.03
+5V_ORP  (via drill 0.41)
  Top 0.152: RO2.2 45.05,34.76 v45.85,35.56 | RO1.2 39.97,34.76 39.75,34.54 v39.62,34.54 | SJ1.1 56.52,36.7 56.13,37.08 v56.01,37.21
  Bottom 0.152: CO7.1 37.97,33.4 37.21,32.64 IC1.12 | CO7.1 CO8.1 CO5.1 39.54,34.63 v39.62,34.54 | CO7.1 CO6.1 | IC1.17 40.47,29.55 v40.01,29.08 | RO_TOP.2 v45.85,35.56 46.99,35.56 48.26,36.83 55.63,36.83 v56.01,37.21 56.52,37.72 56.52,38.48 | 56.52,38.48 56.26,38.73 56.26,40.26 56.45,40.45 IC10.1 57.48,40.35 CO16.2 | 56.52,38.48 57.32,38.48 IC10.3
  pour Powers: 35.94,36.58 35.94,26.8 46.74,26.8 46.74,36.58
+5V_PH  (via drill 0.41)
  Top 0.152: RP1.2 31.66,34.76 v32,34.42 32.35,34.76 RP2.2 | SJ2.1 24.26,37.34 v24.77,36.83
  Bottom 0.152: CP07.1 CP05.1 30.7,34.71 30.99,34.42 v32,34.42 32,33.57 CP8.1 CP6.1 30.7,32.68 30.99,32.38 31.24,32.38 31.37,32.26 31.37,31.1 IC2.17 | 28.08,31.87 IC2.12 28.08,29.83 v28.32,29.59 | v26.67,34.42 26.54,34.54 26.54,34.8 25.82,35.52 RP_TOP.2 24.77,35.56 | IC12.3 15.15,38.35 14.48,38.35 14.22,38.61 14.22,40.13 14.41,40.32 IC12.1 15.25,40.35 CP16.2 18.58,40.35 19.56,39.37 19.56,38.48 22.48,35.56 24.77,35.56 | v24.77,36.83 24.77,35.56
  pour Powers (rank 3): 34.92,26.8 24.26,26.8 24.26,36.58 34.92,36.58
-4.5V_ORP  (via drill 0.41)
  Top 0.152: IC5.8 57.96,20.52 58.67,19.81 59.48,19.81 CO12.2 59.69,19.77 v59.69,20.7 | v63.88,27.05 v63.88,21.84
  Bottom 0.152: CO9.2 65.12,19.49 IC3.1 63.61,20.34 63.25,20.7 | 63.25,20.7 v59.69,20.7 | IC11.2 64.39,28.57 64.14,28.32 64.14,27.3 v63.88,27.05 | 63.25,20.7 63.88,21.34 v63.88,21.84
-4.5V_PH  (via drill 0.41)
  Top 0.152: CP12.2 11.3,32.38 12.06,31.62 12.06,30.4 IC6.8 9.91,30.35 v8,28.45
  Bottom 0.152: CP09.2 10.13,19.49 IC4.1 8.49,27.96 v8,28.45 IC13.2
BUF_IN_ORP
  Bottom 0.152: RO15.2 62.83,31.28 63.5,30.61 63.5,27.81 63.37,27.69 62.64,27.69 IC11.4 62.58,26.03 RO5.1
BUF_IN_PH
  Bottom 0.152: RP15.2 2.75,31.03 3.43,30.35 3.43,27.69 3.17,27.43 2.58,27.43 IC13.4 2.67,27.34 RP5.1
BUF_OUT_ORP  (via drill 0.41)
  Top 0.152: RO12.1 47.92,39.46 48.77,38.61 v48.77,36.2
  Bottom 0.152: IC11.1 65.15,29.55 65.15,30.73 62.9,32.98 RO15.1 62.06,33.66 57.4,33.66 55.75,35.31 49.66,35.31 v48.77,36.2
BUF_OUT_PH  (via drill 0.41)
  Top 0.152: RP12.1 11.56,39.5 10.29,38.35 10.29,36.96 v7.11,33.78
  Bottom 0.152: IC13.1 5.11,30.28 | 5.11,30.28 RP15.1 | v7.11,33.78 7.11,32.54 5.11,30.28
GND  (via drill 0.41, 3.2)
  Top 0.152: U$1.6 33.73,6.55 v34.54,7.37 | IC16.2 33.02,11.56 v32.51,11.05 | RT4.2 29.38,11.26 v29.08,11.05
  Top 0.61: C3.2 35.56,15.24 35.56,16.51 v35.69,16.89
  Grounds 0.152: v41.66,8.13 41.02,8.26
  Grounds 0.406: 35.56,27.3 35.56,36.96 JP1.7
  Bottom 0.152: 29.12,6.22 C6.1 | C4.2 29.08,2.29 | IC14.4 34.47,7.44 v34.54,7.37 | C7.1 40.98,7.58 | 27.6,19.56 RP13.1 | CP2.2 29.12,22.52 29.34,22.73 29.34,24.02 IC2.7 29.38,25.19 29.59,25.4 30.1,25.4 30.61,25.4 30.73,25.27 30.73,24.11 IC2.5 | CO2.2 42.89,22.39 42.42,22.86 IC1.1 v42.42,25.65 | IC1.5 39.82,25.34 39.81,25.34 39.75,25.4 38.61,25.4 38.48,25.27 38.48,24.1 IC1.7 38.52,22.9 38.1,22.48 38.1,21.76 CO4.2 | CP4.2 33.91,21.76 33.91,22.48 33.78,22.61 33.4,22.61 33.27,22.73 IC2.1 v33.28,25.52 v33.27,25.53 | IC1.10 36.57,25.52 v36.83,25.78 | CO3.2 36.62,19.68 RO13.1 | v6.35,11.43 1.78,11.43 0.51,12.7 0.51,33.78 3.43,36.7 3.94,36.7 8,40.77 8.38,40.77 12.7,45.21 30.73,45.21 32.38,43.31 32.38,40.89 33.53,39.88 33.53,38.99 JP1.7 | v63.5,11.43 67.69,11.43 69.6,13.34 69.6,33.27 64.64,38.23 64.39,38.23 57.4,45.21 46.1,45.21 44.96,44.2 44.96,40.01 JP1.15
  Bottom 0.305: v30.1,26.04 30.1,25.4
  Bottom 0.406: 27.6,19.56 CP1.2 CP2.2 | CO1.2 CO2.2 | CO4.2 CO3.2 | CP3.2 CP4.2 | IC2.10 26.85,24.06 v26.67,23.88 | RO13.1 36.45,19.18 v36.83,18.8 | v38.86,20.7 38.1,20.7 | v29.84,20.57 v28.32,20.57
  Bottom 0.61: 29.12,6.22 C5.2 C4.2 | 29.08,2.29 v28.32,3.05 | 40.98,7.58 v41.66,8.13 | C7.1 C9.2 C8.2 | v35.69,16.89 34.67,16.89 v34.67,17.78 | v29.08,11.05 v31.37,11.05 34.16,11.05 34.54,11.43 34.54,12.57
  other vias: 33.27,20.57 43.43,20.7
  pour Grounds: 24.89,27.56 46.48,27.56 46.35,-1.27 24.77,-1.27
  pour Grounds (rank 4): 24.38,45.72 46.23,45.72 46.23,37.08 24.38,37.08
GNDORP_ISO  (via drill 0.41)
  Top 0.152: CO12.1 62.36,19.68 | 62.36,19.68 CO13.1 | CO15.1 46.86,41.66 v46.35,42.16 | RO9.1 58.46,43.27 59.05,42.67 v59.05,42.42 | RO11.1 RO10.1 47.92,34.2 v47.5,33.78 | IC9.3 52.45,42.93 v53.59,44.07 | v62.36,18.8 62.36,19.68 | CO14.1 55.24,35.09 v55.24,34.29
  Top 0.61: v66.04,21.97 66.55,21.46 IC5.9
  Bottom 0.152: IC1.11 | 39.82,29.92 39.62,29.72 | 38.48,31.02 IC1.14 | 38.52,29.76 38.48,29.72 | 43.63,31.06 v43.69,31.11 | 41.24,34.84 41.4,34.67 | 41.66,34.67 v41.91,34.42 | CO6.2 41.24,34 | RO4.1 53.38,34.51 v53.72,34.04 | RO14.2 67.31,23.11 v66.04,21.97 | 67.02,18.63 66.93,18.54 | 58.29,39.5 58.42,39.37 | 58.8,38.61 59.4,38.61 CO16.1 | IC3.2 62.61,18.54 v62.36,18.8
  Bottom 0.406: CO7.2 36.36,32.6 36.58,32.38 IC1.11 v36.58,29.34 36.96,29.72 38.48,29.72 39.62,29.72 | IC1.16 39.82,29.92 | IC1.14 38.52,29.76 | RO_BOT.1 44.41,31.84 v43.69,31.11 | IC1.20 43.63,31.06
  Bottom 0.61: CO7.2 CO8.2 | CO5.2 41.24,34.84 | 41.4,34.67 41.66,34.67 | 41.24,34 41.4,34.16 41.66,34.16 v41.91,34.42 | IC3.2 66.93,18.54 v68.71,18.54 | CO10.2 CO9.1 67.02,18.63 | RO3.1 59.4,26.2 v59.69,25.91 | IC10.2 58.29,39.5 | 58.42,39.37 58.42,38.99 58.8,38.61 | 59.4,38.61 60.33,38.61 v60.71,38.99 | CO17.1 51.9,38.65 v51.44,39.12
  other vias: 36.32,34.42
  pour Grounds: 35.94,36.83 35.94,27.94 46.61,27.94 46.61,36.83
  pour Grounds: 46.48,45.72 46.48,30.48 52.96,30.48 52.96,5.97 69.85,5.97 69.85,45.85 46.99,45.85
GNDPH_ISO  (via drill 0.41)
  Top 0.152: CP12.1 CP13.1 5.8,33.62 v6.1,33.91 | v12.95,34.04 13.12,34.2 RP10.1 RP11.1 v11.81,37.34 | IC6.9 1.4,30.35 v1.14,30.61 | v19.18,34.67 19.56,34.67 19.81,34.42 20.49,34.42 CP14.1 | RP9.1 22.61,43.05 v22.86,43.31 | IC7.3 17.4,42.8 v18.54,43.94 | CP15.1 13.12,43.09 v13.21,43.18
  Bottom 0.152: 11.9,18.58 v11.94,18.54 11.9,18.5 | CP07.2 CP8.2 33.91,33.4 33.91,32.13 v34.16,31.88 34.16,31.62 33.66,31.11 33.33,31.11 IC2.20 | 30.73,31 IC2.16 | 28.96,33.36 CP6.2 | RP_BOT.1 25.82,33.36 26.67,32.51 27.3,32.51 27.43,32.38 IC2.11 | 17.06,38.99 CP16.1 | RP4.1 14.19,31.71 v13.72,31.24 | RP3.1 18.88,34.38 v19.18,34.67
  Bottom 0.406: IC2.11 27.43,29.21 27.81,28.83 29.38,28.83 | 30.73,31 30.73,29.21 30.35,28.83 29.38,28.83 | 28.96,33.36 28.96,32.64 29.38,32.22 IC2.14 29.38,28.83 | 29.38,28.83 29.38,28.74 v29.34,28.32
  Bottom 0.61: IC4.2 v11.94,18.54 | CP09.1 11.9,18.58 | CP10.2 11.9,18.5 | CP05.2 CP6.2 | RP14.2 7.11,23.24 v6.86,22.99 | IC12.2 16,39.37 16.38,38.99 17.06,38.99 18.29,38.99 v18.54,39.24 | v11.81,37.34 11.05,37.34 10.54,37.85 CP17.1
  other vias: 28.96,34.42 34.42,34.42
  pour Grounds: 34.92,36.83 34.92,27.94 24.13,27.94 24.13,36.83
  pour Grounds: 24.13,45.85 24.13,30.48 17.02,30.48 17.02,5.84 11.94,5.84 11.94,7.62 7.62,7.62 7.62,5.84 -0.13,5.84 -0.13,45.85
GUARD_NEG_ORP
  Top 0.152: IC5.2 60.2,29.08 60.71,28.57 60.71,27.05 60.2,26.54 IC5.4 57.78,26.54 56.77,26.54 56.52,26.8 56.52,28.83 56.77,29.08 57.66,29.08 57.78,28.96
GUARD_NEG_PH
  Top 0.152: IC6.4 10.03,25.27 9.4,24.64 9.4,23.37 10.03,22.73 IC6.2 12.7,22.73 13.08,22.73 13.59,23.24 13.59,24.64 12.95,25.27 11.56,25.27 11.43,25.4
GUARD_POS_ORP
  Top 0.152: IC5.5 59.94,25.27 60.71,24.51 60.71,23.11 60.33,22.73 58.42,22.73 IC5.7 56.77,22.73 56.52,22.99 56.52,24.89 56.9,25.27 IC5.5
GUARD_POS_PH
  Top 0.152: IC6.7 9.91,29.08 9.4,28.57 9.4,27.18 10.03,26.54 IC6.5 12.7,26.54 13.08,26.54 13.59,27.05 13.59,28.57 13.08,29.08 11.56,29.08 11.43,29.21
INA_OUT_ORP  (via drill 0.41)
  Top 0.152: IC5.11 66.42,24 66.04,23.62 66.04,23.24 v65.79,22.99
  Bottom 0.152: v65.79,22.99 62.99,22.99 62.74,23.24 RO5.2
INA_OUT_PH  (via drill 0.41)
  Top 0.152: IC6.11 3.43,27.81 v3.94,27.3
  Bottom 0.152: v3.94,27.3 3.94,27.05 3.81,26.92 3.81,24.51 3.43,24.13 2.71,24.13 RP5.2
N$1
  Bottom 0.152: CP11.1 5.8,19.3 IC4.6
N$2
  Bottom 0.152: CP11.2 2.58,18.63 2.79,18.41 5.86,18.41 IC4.5
N$3
  Top 0.152: RT1.2 RT2.1 39.71,8.55 38.35,8.51 37.18,9.78 IC16.4
N$4
  Top 0.152: RG1_PH.1 11.05,19.56 12.06,20.57 12.06,21.41 IC6.1
N$5
  Top 0.152: RG2_PH.2 RG1_PH.2
N$6  (via drill 0.41)
  Top 0.152: v59.82,24 IC5.6
  Bottom 0.152: ORP.CON_SIG 50.45,32.42 50.8,32.77 52.67,32.77 RO4.2 53.81,32.8 56.26,30.35 59.18,30.35 60.33,29.21 60.33,24.51 v59.82,24
N$7
  Top 0.152: RT3.1 RT4.1 33.31,9.56 33.78,10.03 33.78,10.58 IC16.3
N$9
  Bottom 0.152: C6.2 R4.2
N$10
  Bottom 0.152: CO11.1 61.05,19.43 IC3.6
N$11
  Bottom 0.152: CO11.2 57.78,19.43 58.67,18.54 IC3.5
N$12  (via drill 0.41)
  Top 0.152: v59.56,27.94 58.09,27.94 IC5.3
  Bottom 0.152: ORP.CON_GND 55.73,27.9 RO3.2 59.52,27.9 v59.56,27.94
N$13
  Top 0.152: RG1_ORP.1 59.05,32.38 57.91,31.24 57.91,30.4 IC5.1
N$14
  Top 0.152: RG1_ORP.2 RG2_ORP.2
N$16
  Top 0.152: RG2_PH.1 3.43,19.56 2.41,20.57 2.41,21.41 IC6.16
N$17
  cutout Powers: 42.16,15.88 42.16,10.79 42.16,15.88 37.85,15.88
N$18  (via drill 0.41)
  Top 0.152: v10.03,27.81 IC6.6
  Bottom 0.152: v10.03,27.81 10.76,27.08 PH.CON_GND 14.91,27.34 RP4.2
N$19
  cutout Grounds: 42.16,15.88 42.16,10.79 42.16,15.88 37.85,15.88
N$20
  Top 0.152: RG2_ORP.1 66.55,32.38 67.44,31.5 67.44,30.43 IC5.16
N$21
  Bottom 0.152: IC14.5 38.83,7.44 C7.2
N$22
  Top 0.152: IC9.1 53.89,41.7 54.61,42.42 56.81,42.42 RO9.2 57.62,41.53 56.9,41.53 56.52,41.15 56.52,40.26 56.22,39.97 RO7.1
N$23
  Top 0.152: IC9.2 52.95,42.79 53.34,43.18 55.41,43.18 RO8.1
N$24
  Top 0.152: IC9.6 51.44,37.28 AIN2_ORP.TP 51.18,35.56 50.67,35.05 49.74,35.05 RO10.2
N$25
  Top 0.152: RO11.2 49.62,38.06 49.91,38.35 51.82,38.35 51.94,38.23 IC9.7 51.95,36.44 52.45,35.94 52.45,35.05 AIN3_ORP.TP
N$26  (via drill 0.41)
  Top 0.152: v10.16,24.13 11.89,24.13 IC6.3
  Bottom 0.152: PH.CON_SIG 17.79,32.42 RP3.2 14.01,32.68 12.95,31.62 12.95,30.1 11.43,28.57 9.91,28.57 9.27,27.94 9.27,25.02 v10.16,24.13
N$27
  Top 0.152: IC7.1 19.01,41.7 19.43,41.27 21.76,41.27 RP9.2 22.61,38.86 21.97,38.23 20.83,38.23 20.57,37.97 RP7.1
N$28
  Top 0.152: IC7.2 17.9,42.54 18.41,43.05 20.32,43.05 20.57,42.8 RP8.1
N$31
  Top 0.152: IC7.6 16.38,37.28 AIN2_PH.TP RP10.2
N$32
  Top 0.152: RP11.2 15.62,37.34 15.88,37.59 15.88,38.1 16.13,38.35 16.76,38.35 16.9,38.22 IC7.7 16.89,36.32 17.27,35.94 17.27,34.54 AIN3_PH.TP
SCL  (via drill 0.41)
  Top 0.152: v38.99,26.54 v41.15,26.54 | 34.92,40.01 34.92,37.59 35.56,36.96 35.56,27.05 34.8,26.29 v34.67,26.29
  Top 0.254: JP1.2 27.3,40.13 34.8,40.13 34.92,40.01
  Bottom 0.152: IC2.2 32.63,25.9 33.78,27.05 34.67,27.05 | v41.15,26.54 41.78,25.78 41.78,24.07 IC1.2 | 34.67,27.05 38.35,27.05 v38.99,26.54 | v34.67,26.29 34.67,27.05
SCL_ISO_ORP  (via drill 0.41)
  Top 0.152: v42.04,29.08 42.04,32.04 RO2.1 43.98,33.06 44.2,33.27 45.97,33.27 46.86,32.38 54.36,32.38 56.39,34.42 56.39,35.69 56.01,36.07 54.74,36.07 54.48,36.32 53.59,36.32 53.47,36.45 53.47,37.28 IC9.10
  Bottom 0.152: IC1.19 41.77,29.35 v42.04,29.08
SCL_ISO_PH  (via drill 0.41)
  Top 0.152: v33.02,29.46 33.02,29.59 33.27,29.84 RP2.1 33.36,33.02 32.26,33.02 31.37,33.91 29.46,33.91 29.21,33.66 28.83,33.66 28.57,33.91 27.81,33.91 26.29,32.38 v26.29,31.88 | IC7.10 18.4,36.34 v18.92,35.94
  Bottom 0.152: IC2.19 32.63,29.86 v33.02,29.46 | v18.92,35.94 19.81,35.94 20.95,34.8 21.59,34.8 21.97,34.42 23.88,34.42 24.51,33.78 24.51,32.64 25.27,31.88 v26.29,31.88
SDA
  Bottom 0.152: IC2.3 31.98,26.01 33.53,27.56 35.81,27.56 | 35.81,27.56 38.99,27.56 41.15,25.53 41.15,24.09 IC1.3 | 35.81,27.56 35.81,28.57 35.31,29.21 35.31,37.08 35.18,37.21
  Bottom 0.254: JP1.4 28.57,41.27 29.59,40.13 29.84,39.88 29.84,37.21 35.18,37.21
SDA_ISO_ORP  (via drill 0.41)
  Top 0.152: v40.89,29.08 40.64,29.97 RO1.1 41.7,33.06 42.55,33.91 46.23,33.91 46.99,33.15 53.85,33.15 54.48,33.78 54.48,35.81 54.36,35.94 53.47,35.94 52.96,36.45 IC9.9
  Bottom 0.152: IC1.18 41.12,29.31 v40.89,29.08
SDA_ISO_PH  (via drill 0.41)
  Top 0.152: v31.5,29.34 30.48,30.35 RP1.1 30.44,33.02 27.94,33.02 27.18,32.26 27.18,31.24 26.92,30.99 v26.29,30.99 | IC7.9 17.9,35.82 v18.41,35.31
  Bottom 0.152: IC2.18 31.98,29.82 v31.5,29.34 | v18.41,35.31 19.56,35.31 20.57,34.29 21.34,34.29 21.72,33.91 23.5,33.91 24,33.4 24,32.38 25.4,30.99 v26.29,30.99
SIG+
  Top 0.152: RT3.2 30.23,5.46 33.15,2.54 PT1000.1 34.29,2.55 34.29,3.68 35.85,5.25 U$1.1
SIG-
  Top 0.152: U$1.3 U$1.2 39.59,5.91 RT1.1
SIG_ORP
  Top 0.152: CO15.2 51.41,41.66 IC9.5 | CO15.2 49.62,43.01 TP_SIG_ORP.TP | CO15.2 RO12.2
SIG_PH
  Top 0.152: PTP1.TP 14.86,41.7 CP15.2 | CP15.2 16.36,41.66 IC7.5 | CP15.2 RP12.2
SUPP_ADS_ORP
  Top 0.152: 53.59,35.22 CO14.2 53.25,35.56 53.21,35.56 53.09,35.69 53.09,35.81 52.45,36.45 IC9.8 52.45,38.23 52.7,38.48 54.48,38.48 | SJ1.2 55.54,38.23 RO7.2 55.46,38.23 54.74,38.23 54.48,38.48 | RO8.2 55.41,41.57 54.48,40.64 54.48,38.48
SUPP_ADS_PH
  Top 0.152: RP8.2 RP7.2 19.65,39.08 19.3,38.73 19.3,38.48 | 19.3,38.48 19.3,36.58 19.81,36.07 20.54,36.07 CP14.2 20.61,36.07 21.84,36.07 22.35,35.56 22.86,35.56 22.99,35.69 SJ2.2 | IC7.8 17.4,38.23 17.65,38.48 19.3,38.48
TEMP
  Top 0.152: RT2.2 37.88,10.25 36.7,11.43 35.34,11.39 34.92,11.81 34.92,12.32 34.8,12.45 33.81,12.45 IC16.1 33.69,12.57 33.02,13.21 33.02,19.05 38.86,24 38.99,24.13 38.99,25.65 38.1,26.67 38.1,29.21 38.73,29.84 JP1.11
VCC_ORP_ENA  (via drill 0.41)
  Top 0.152: JP1.5 31.11,37.21 32,36.32 34.29,36.32 35.18,35.43 35.18,27.81 33.66,26.42 33.66,26.04 v34.42,25.27
  Bottom 0.152: IC1.8 37.87,22.89 37.34,22.35 36.58,22.35 36.45,22.23 | 36.45,22.23 RO13.2 | v34.42,25.27 34.42,24.38 36.45,22.23
VCC_PH_ENA  (via drill 0.41)
  Top 0.152: JP1.1 26.04,36.2 25.4,35.56 25.4,29.21 v27.94,26.67
  Bottom 0.152: RP13.2 27.69,21.42 27.69,22.1 28.19,22.61 28.45,22.61 28.7,22.86 28.7,24.03 IC2.8 28.7,24.09 28.7,25.91 v27.94,26.67
VCC_TB  (via drill 0.41)
  Top 0.152: U$1.8 U$1.7 34.09,5.9 v35.56,7.37
  Bottom 0.152: C8.1 C9.1 36.58,4.83 36.2,5.21 36.2,6.48 36.32,6.6 | 36.32,6.6 36.58,6.86 37.69,6.86 IC14.6 | R4.1 31.15,6.26 32.13,7.24 32.13,7.62 32.51,8 34.92,8 v35.56,7.37 36.32,6.6
VREF_ORP  (via drill 0.41)
  Top 0.152: TP_VREF_ORP.TP IC9.4 | IC9.4 | IC9.4 51.94,40.64 53.09,39.5 53.72,39.5 v53.85,39.37 | v54.23,37.59 54.23,37.08 54.86,36.45 56.26,36.45 57.4,35.18 63.88,35.18 v65.15,33.91
  Bottom 0.152: IC11.3 66.04,27.62 | 66.04,27.62 66.48,27.62 67.31,26.8 RO14.1 66.38,25.87 66.17,25.65 66.17,24.38 65.91,24.13 65.06,24.13 RO6.2 | v53.85,39.37 53.85,37.97 v54.23,37.59 | v65.15,33.91 66.04,33.02 66.04,27.62
VREF_PH  (via drill 0.41)
  Top 0.152: PTP2.TP 16.9,43.17 IC7.4 16.9,39.89 15.49,38.48 11.81,38.48 11.05,37.85 11.05,36.7 v8.13,33.78 | 7.49,27.81 v7.49,27.56 7.24,27.94 v7.24,29.21
  Bottom 0.152: RP6.2 4.87,24.13 5.71,24.13 5.97,24.38 5.97,25.53 6.31,25.87 RP14.1 7.11,27.05 7.05,27.11 | IC13.3 6.67,27.5 7.05,27.11 | v8.13,33.78 8.13,30.1 v7.24,29.21 | v7.49,27.56 7.05,27.11
VSEL
  Bottom 0.152: IC1.13 37.87,32.28 38.1,32.51 42.67,32.51 42.8,32.64 42.8,33.31 RO_BOT.2 RO_TOP.1
VSEL1
  Bottom 0.152: RP_TOP.1 RP_BOT.2 27.81,33.11 27.81,32.64 27.94,32.51 28.32,32.51 28.73,32.1 IC2.13

### Text on the board
Top: Lay 1
Grounds: 2
Powers: 3
Bottom: 4
bNames: pH/ORP V10 | ORP | PH